# Altium schematic sheet 15-PWR_1.SchDoc: KARGOBOT-TBOX-V2.0
size 513 x 386 mm; Page Create Date: March  8, 1995; Page Number: 4; Page Size: C; Page Count: 81; RevCode: A; DsnPath: C:\Users\Administrator\Desktop\123\KARGOBOT-TCU-ORIN-V1.1.DSN; SchematicName: KARGOBT-TCU-ORIN-V1.1; PageName: N100; PageSize: C; TopSchematic: True
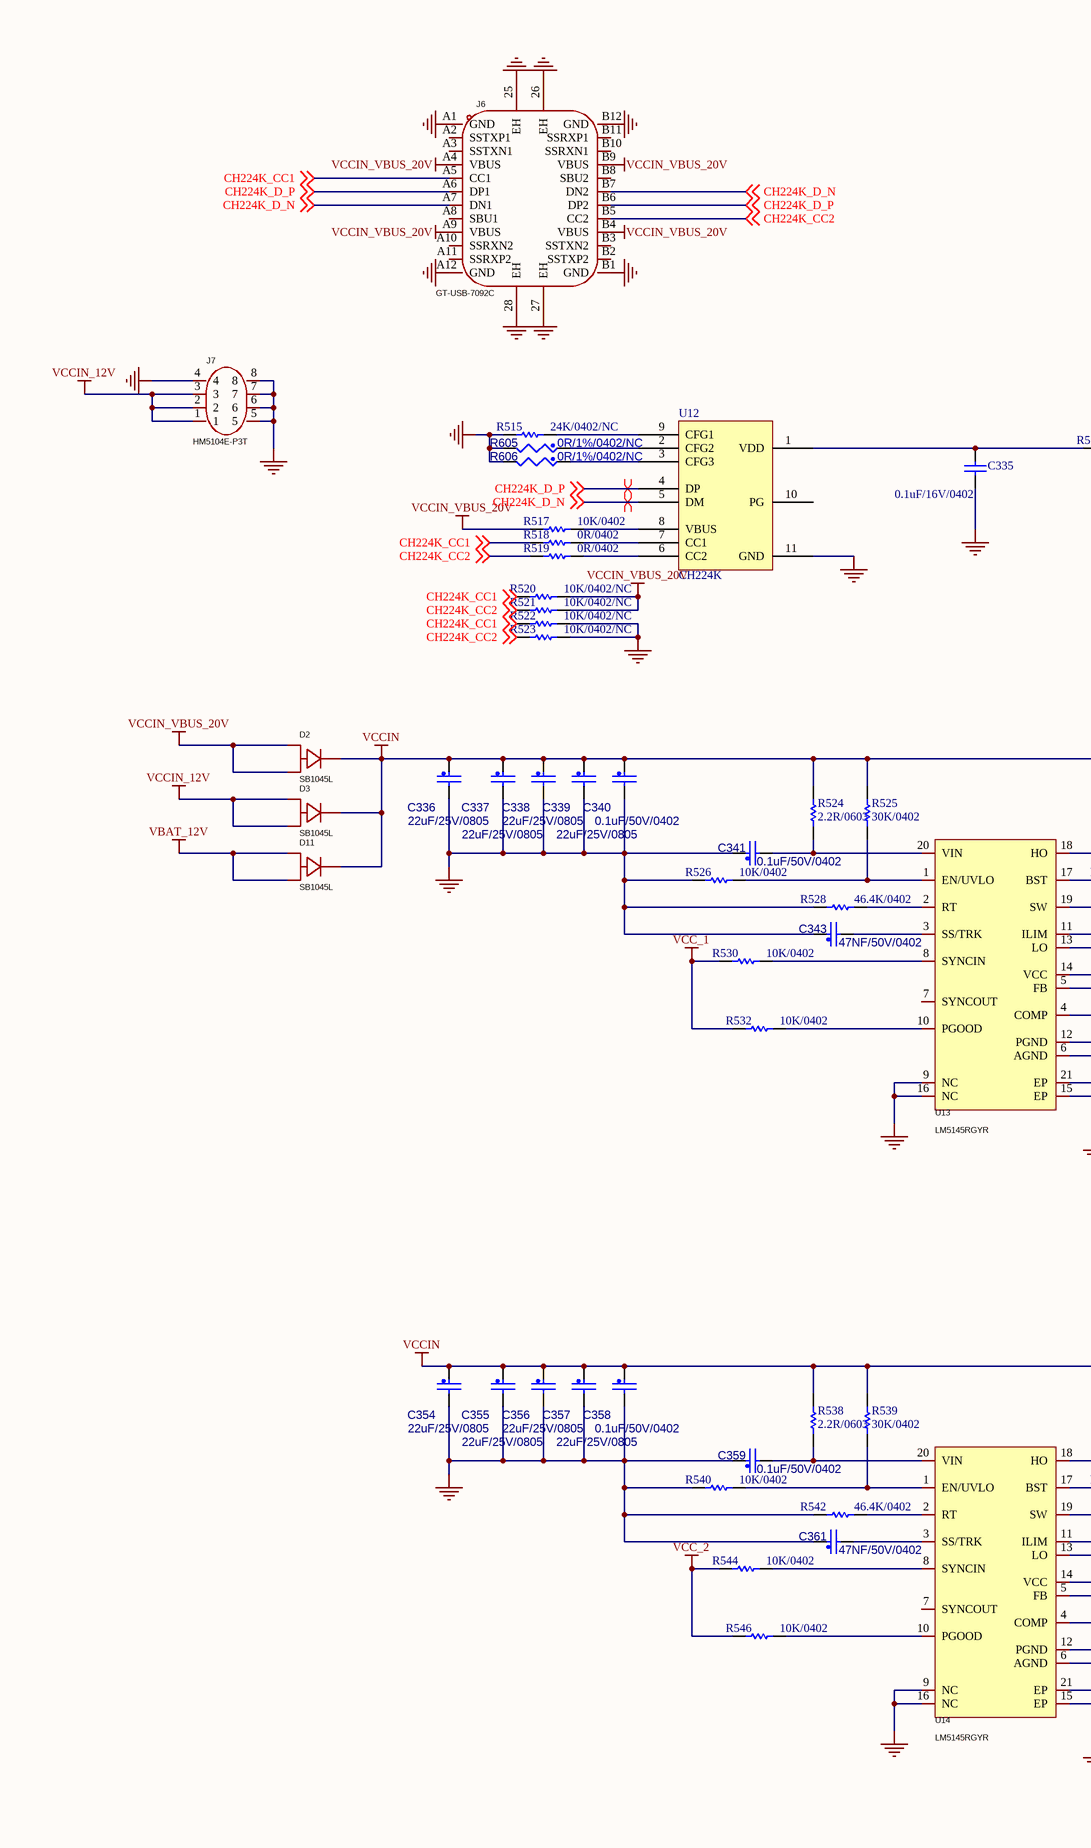
[diagram p0: 15-PWR_1.SchDoc, left]
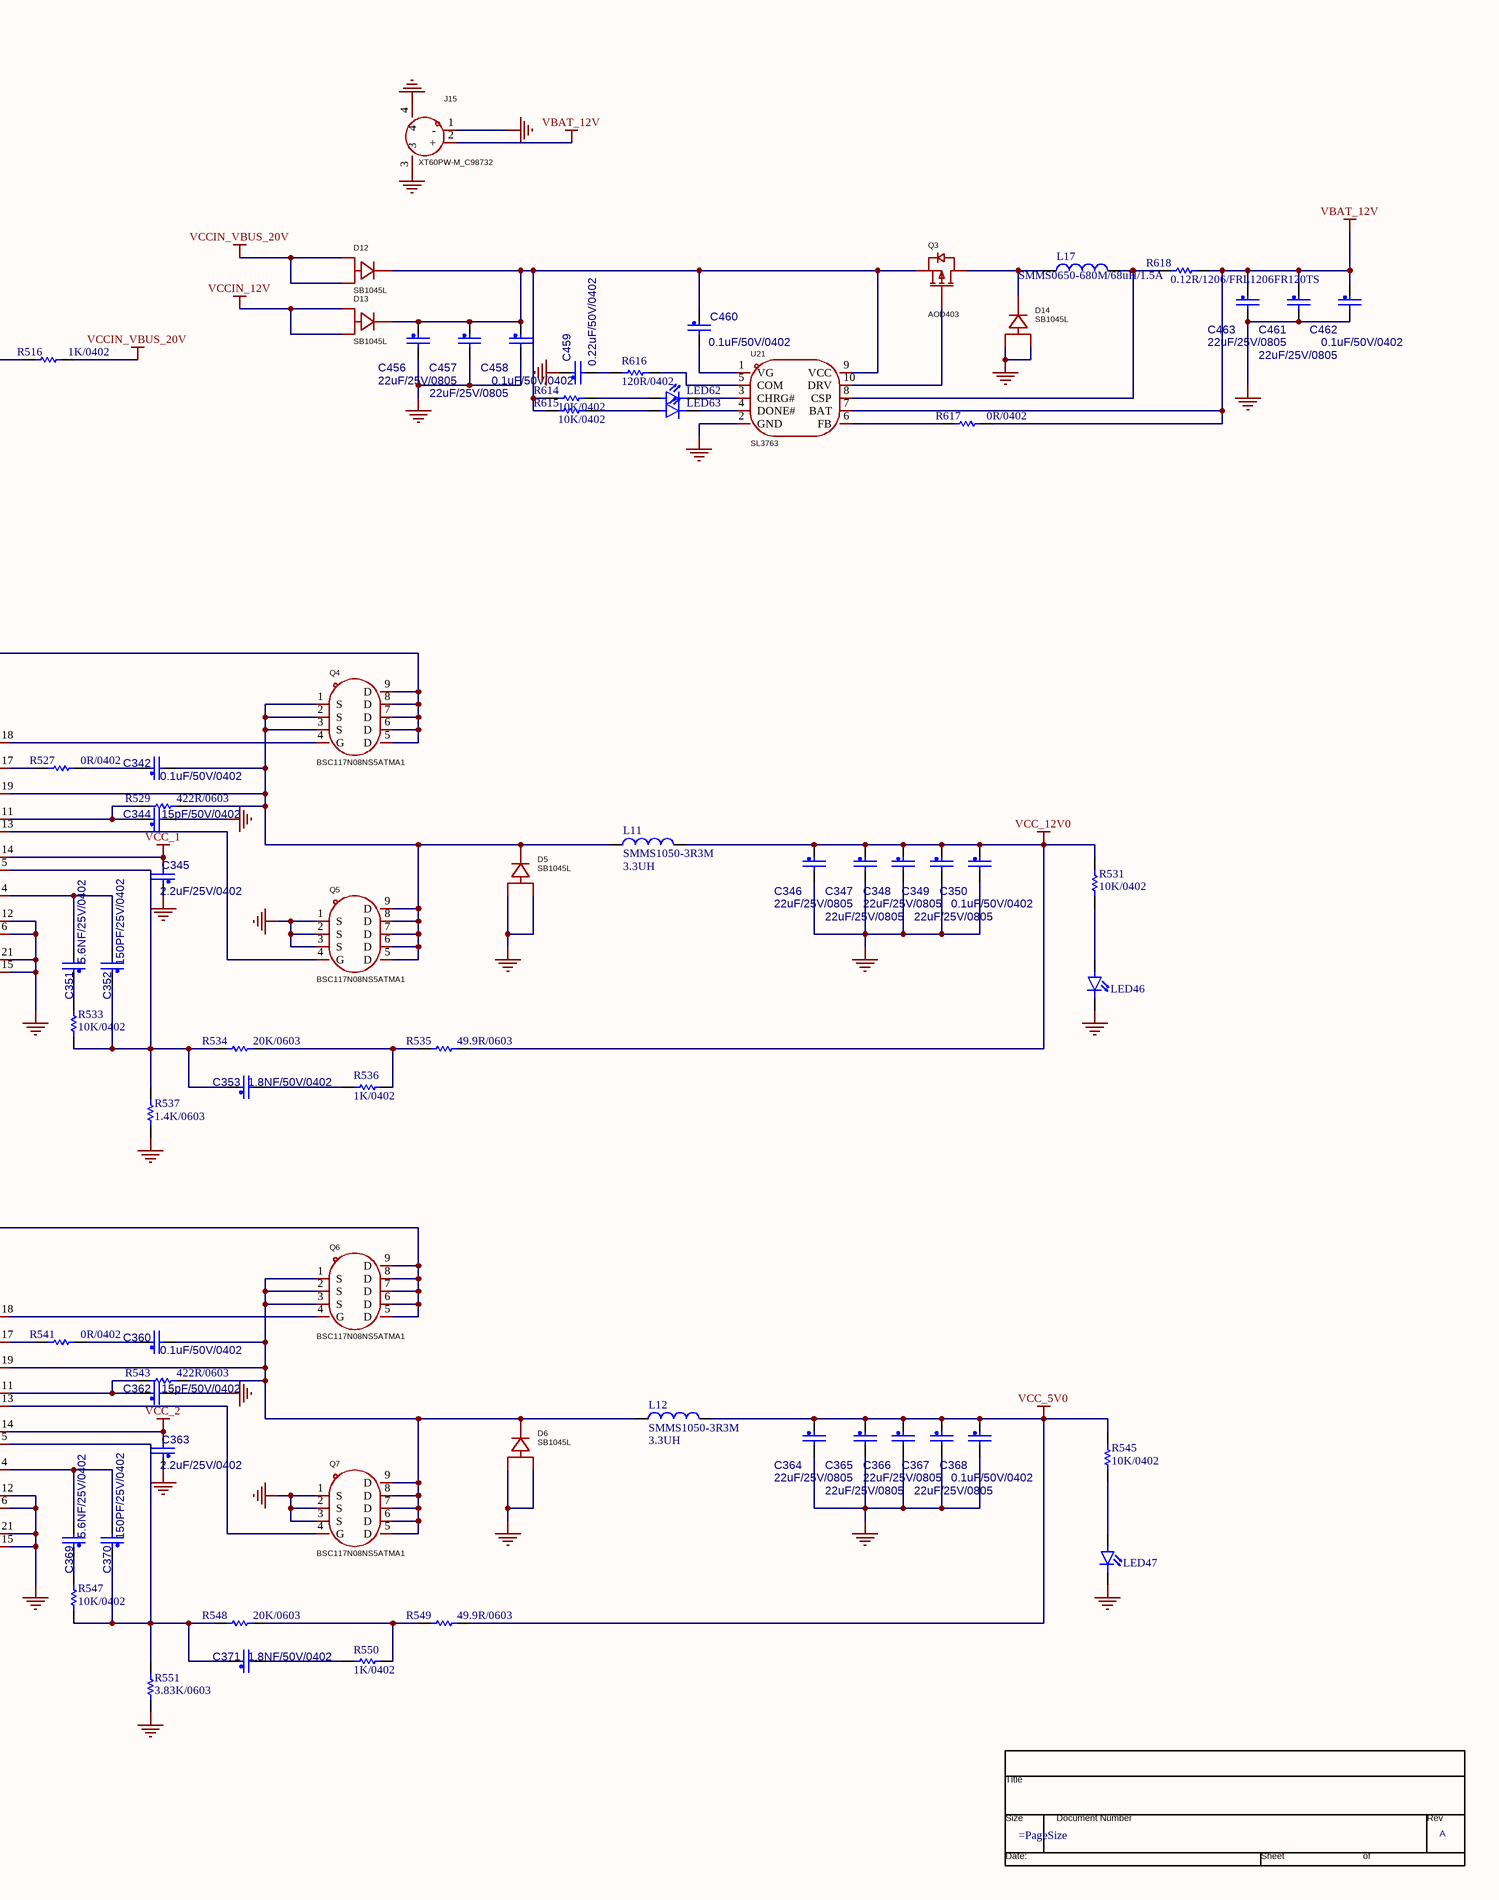
[diagram p1: 15-PWR_1.SchDoc, right]

## Parts
*  RevCode: A  (graphical)
C335  0.1uF/16V/0402  [C0402]
C336  value 22uF/25V/0805  [C0805]  (hidden comment: CAP_NP)
C337  value 22uF/25V/0805  [C0805]  (hidden comment: CAP_NP)
C338  value 22uF/25V/0805  [C0805]  (hidden comment: CAP_NP)
C339  value 22uF/25V/0805  [C0805]  (hidden comment: CAP_NP)
C340  value 0.1uF/50V/0402  [C0402]  (hidden comment: CAP_NP)
C341  value 0.1uF/50V/0402  [C0402]  (hidden comment: CAP_NP)
C342  value 0.1uF/50V/0402  [C0402]  (hidden comment: CAP_NP)
C343  value 47NF/50V/0402  [C0402]  (hidden comment: CAP_NP)
C344  value 15pF/50V/0402  [C0402]  (hidden comment: CAP_NP)
C345  value 2.2uF/25V/0402  [C0402]  (hidden comment: CAP_NP)
C346  value 22uF/25V/0805  [C0805]  (hidden comment: CAP_NP)
C347  value 22uF/25V/0805  [C0805]  (hidden comment: CAP_NP)
C348  value 22uF/25V/0805  [C0805]  (hidden comment: CAP_NP)
C349  value 22uF/25V/0805  [C0805]  (hidden comment: CAP_NP)
C350  value 0.1uF/50V/0402  [C0402]  (hidden comment: CAP_NP)
C351  value 5.6NF/25V/0402  [C0402]  (hidden comment: CAP_NP)
C352  value 150PF/25V/0402  [C0402]  (hidden comment: CAP_NP)
C353  value 1.8NF/50V/0402  [C0402]  (hidden comment: CAP_NP)
C354  value 22uF/25V/0805  [C0805]  (hidden comment: CAP_NP)
C355  value 22uF/25V/0805  [C0805]  (hidden comment: CAP_NP)
C356  value 22uF/25V/0805  [C0805]  (hidden comment: CAP_NP)
C357  value 22uF/25V/0805  [C0805]  (hidden comment: CAP_NP)
C358  value 0.1uF/50V/0402  [C0402]  (hidden comment: CAP_NP)
C359  value 0.1uF/50V/0402  [C0402]  (hidden comment: CAP_NP)
C360  value 0.1uF/50V/0402  [C0402]  (hidden comment: CAP_NP)
C361  value 47NF/50V/0402  [C0402]  (hidden comment: CAP_NP)
C362  value 15pF/50V/0402  [C0402]  (hidden comment: CAP_NP)
C363  value 2.2uF/25V/0402  [C0402]  (hidden comment: CAP_NP)
C364  value 22uF/25V/0805  [C0805]  (hidden comment: CAP_NP)
C365  value 22uF/25V/0805  [C0805]  (hidden comment: CAP_NP)
C366  value 22uF/25V/0805  [C0805]  (hidden comment: CAP_NP)
C367  value 22uF/25V/0805  [C0805]  (hidden comment: CAP_NP)
C368  value 0.1uF/50V/0402  [C0402]  (hidden comment: CAP_NP)
C369  value 5.6NF/25V/0402  [C0402]  (hidden comment: CAP_NP)
C370  value 150PF/25V/0402  [C0402]  (hidden comment: CAP_NP)
C371  value 1.8NF/50V/0402  [C0402]  (hidden comment: CAP_NP)
C456  value 22uF/25V/0805  [C0805]  (hidden comment: CAP_NP)
C457  value 22uF/25V/0805  [C0805]  (hidden comment: CAP_NP)
C458  value 0.1uF/50V/0402  [C0402]  (hidden comment: CAP_NP)
C459  value 0.22uF/50V/0402  [C0402]  (hidden comment: CAP_NP)
C460  value 0.1uF/50V/0402  [C0402]  (hidden comment: CAP_NP)
C461  value 22uF/25V/0805  [C0805]  (hidden comment: CAP_NP)
C462  value 0.1uF/50V/0402  [C0402]  (hidden comment: CAP_NP)
C463  value 22uF/25V/0805  [C0805]  (hidden comment: CAP_NP)
D2  SB1045L  [TO-277_3P-L5.4-W4.0-LS6.5-TR]
D3  SB1045L  [TO-277_3P-L5.4-W4.0-LS6.5-TR]
D5  SB1045L  [TO-277_3P-L5.4-W4.0-LS6.5-TR]
D6  SB1045L  [TO-277_3P-L5.4-W4.0-LS6.5-TR]
D11  SB1045L  [TO-277_3P-L5.4-W4.0-LS6.5-TR]
D12  SB1045L  [TO-277_3P-L5.4-W4.0-LS6.5-TR]
D13  SB1045L  [TO-277_3P-L5.4-W4.0-LS6.5-TR]
D14  SB1045L  [TO-277_3P-L5.4-W4.0-LS6.5-TR]
J6  GT-USB-7092C  [USB-C-SMD_GT-USB-7092C]
J7  HM5104E-P3T  [HM5104E-P3T]
J15  XT60PW-M_C98732  [CONN-TH_XT60PW-M]
L11  SMMS1050-3R3M  value 3.3UH  [SMMS1050-3R3M]
L12  SMMS1050-3R3M  value 3.3UH  [SMMS1050-3R3M]
L17  SMMS0650-680M/68uH/1.5A  [SMMS0650-680M]
LED46  LED_GREEN  [LED0603]  (value not drawn)
LED47  LED_GREEN  [LED0603]  (value not drawn)
LED62  LED_GREEN  [LED0603]  (value not drawn)
LED63  LED_GREEN  [LED0603]  (value not drawn)
Q3  AOD403  [TO-252-3_L6.6-W6.1-P4.58-LS10.1-BR-2]
Q4  BSC117N08NS5ATMA1  [DFN-8_L5.9-W5.2-P1.27-LS6.2-BL]
Q5  BSC117N08NS5ATMA1  [DFN-8_L5.9-W5.2-P1.27-LS6.2-BL]
Q6  BSC117N08NS5ATMA1  [DFN-8_L5.9-W5.2-P1.27-LS6.2-BL]
Q7  BSC117N08NS5ATMA1  [DFN-8_L5.9-W5.2-P1.27-LS6.2-BL]
R515  24K/0402/NC  [R0402]
R516  1K/0402  [R0402]
R517  10K/0402  [R0402]
R518  0R/0402  [R0402]
R519  0R/0402  [R0402]
R520  10K/0402/NC  [R0402]
R521  10K/0402/NC  [R0402]
R522  10K/0402/NC  [R0402]
R523  10K/0402/NC  [R0402]
R524  2.2R/0603  [R0603]
R525  30K/0402  [R0402]
R526  10K/0402  [R0402]
R527  0R/0402  [R0402]
R528  46.4K/0402  [R0402]
R529  422R/0603  [R0603]
R530  10K/0402  [R0402]
R531  10K/0402  [R0402]
R532  10K/0402  [R0402]
R533  10K/0402  [R0402]
R534  20K/0603  [R0603]
R535  49.9R/0603  [R0603]
R536  1K/0402  [R0402]
R537  1.4K/0603  [R0603]
R538  2.2R/0603  [R0603]
R539  30K/0402  [R0402]
R540  10K/0402  [R0402]
R541  0R/0402  [R0402]
R542  46.4K/0402  [R0402]
R543  422R/0603  [R0603]
R544  10K/0402  [R0402]
R545  10K/0402  [R0402]
R546  10K/0402  [R0402]
R547  10K/0402  [R0402]
R548  20K/0603  [R0603]
R549  49.9R/0603  [R0603]
R550  1K/0402  [R0402]
R551  3.83K/0603  [R0603]
R605  value 0R/1%/0402/NC  [R0402]  (hidden comment: RES_Dup2)
R606  value 0R/1%/0402/NC  [R0402]  (hidden comment: RES_Dup2)
R614  10K/0402  [R0402]
R615  10K/0402  [R0402]
R616  120R/0402  [R0402]
R617  0R/0402  [R0402]
R618  0.12R/1206/FRL1206FR120TS  [R1206]
U12  CH224K  [CH224K_ ESSOP-10]
U13  LM5145RGYR  [VQFN-20_L4.5-W3.5-P0.50-BL-EP]
U14  LM5145RGYR  [VQFN-20_L4.5-W3.5-P0.50-BL-EP]
U21  SL3763  [SSOP-10_L4.9-W3.9-P1.00-LS6.0-BL-1]

## Nets
GND: C335.1 C336.2 C337.2 C338.2 C339.2 C340.2 C341.1 C343.1 C344.2 C345.1 C346.2 C347.2 C348.2 C349.2 C350.2 C354.2 C355.2 C356.2 C357.2 C358.2 C359.1 C361.1 C362.2 C363.1 C364.2 C365.2 C366.2 C367.2 C368.2 C456.2 C457.2 C458.2 C459.1 C461.2 C462.2 C463.2 D5.1(A) D5.3(A) D6.1(A) D6.3(A) D14.1(A) D14.3(A) J6.25(EH) J6.26(EH) J6.27(EH) J6.28(EH) J6.A1(GND) J6.A12(GND) J6.B1(GND) J6.B12(GND) J7.4 J7.5 J7.6 J7.7 J7.8 J15.1(-) J15.3 J15.4 LED46.2 LED47.2 Q5.1(S) Q5.2(S) Q5.3(S) Q7.1(S) Q7.2(S) Q7.3(S) R515.1 R522.2 R523.2 R526.1 R528.2 R537.2 R540.1 R542.2 R551.2 R605.2 R606.2 U12.11(GND) U13.6(AGND) U13.9(NC) U13.12(PGND) U13.15(EP) U13.16(NC) U13.21(EP) U14.6(AGND) U14.9(NC) U14.12(PGND) U14.15(EP) U14.16(NC) U14.21(EP) U21.2(GND)
VBAT_12V: C461.1 C462.1 C463.1 D11.1(A) D11.3(A) J15.2(+) R617.2 R618.2 U21.7(BAT)
VCC_1: C345.2 R530.1 R532.1 U13.14(VCC)
VCC_2: C363.2 R544.1 R546.1 U14.14(VCC)
VCC_5V0: C364.1 C365.1 C366.1 C367.1 C368.1 L12.2 R545.1 R549.1
VCC_12V0: C346.1 C347.1 C348.1 C349.1 C350.1 L11.2 R531.1 R535.1
VCCIN: C336.1 C337.1 C338.1 C339.1 C340.1 C354.1 C355.1 C356.1 C357.1 C358.1 D2.2(K) D3.2(K) D11.2(K) Q4.5(D) Q4.6(D) Q4.7(D) Q4.8(D) Q4.9(D) Q6.5(D) Q6.6(D) Q6.7(D) Q6.8(D) Q6.9(D) R524.2 R525.2 R538.2 R539.2
VCCIN_12V: D3.1(A) D3.3(A) D13.1(A) D13.3(A) J7.1 J7.2 J7.3
VCCIN_VBUS_20V: D2.1(A) D2.3(A) D12.1(A) D12.3(A) J6.A4(VBUS) J6.A9(VBUS) J6.B4(VBUS) J6.B9(VBUS) R516.2 R517.1 R520.2 R521.2
CH224K_CC1: J6.A5(CC1) R518.1 R520.1 R522.1 ; off-sheet CH224K_CC1
CH224K_CC2: J6.B5(CC2) R519.1 R521.1 R523.1 ; off-sheet CH224K_CC2
CH224K_D_N: J6.A7(DN1) J6.B7(DN2) U12.5(DM) ; off-sheet CH224K_D_N
CH224K_D_P: J6.A6(DP1) J6.B6(DP2) U12.4(DP) ; off-sheet CH224K_D_P
NetC335_2: C335.2 R516.1 U12.1(VDD)
NetC341_2: C341.2 R524.1 U13.20(VIN)
NetC342_1: C342.1 R527.2
NetC342_2: C342.2 D5.2(K) L11.1 Q4.1(S) Q4.2(S) Q4.3(S) Q5.5(D) Q5.6(D) Q5.7(D) Q5.8(D) Q5.9(D) R529.1 U13.19(SW)
NetC343_2: C343.2 U13.3(SS/TRK)
NetC344_1: C344.1 R529.2 U13.11(ILIM)
NetC351_1: C351.1 R533.2
NetC351_2: C351.2 C352.2 U13.4(COMP)
NetC352_1: C352.1 C353.1 R533.1 R534.2 R537.1 U13.5(FB)
NetC353_2: C353.2 R536.2
NetC359_2: C359.2 R538.1 U14.20(VIN)
NetC360_1: C360.1 R541.2
NetC360_2: C360.2 D6.2(K) L12.1 Q6.1(S) Q6.2(S) Q6.3(S) Q7.5(D) Q7.6(D) Q7.7(D) Q7.8(D) Q7.9(D) R543.1 U14.19(SW)
NetC361_2: C361.2 U14.3(SS/TRK)
NetC362_1: C362.1 R543.2 U14.11(ILIM)
NetC369_1: C369.1 R547.2
NetC369_2: C369.2 C370.2 U14.4(COMP)
NetC370_1: C370.1 C371.1 R547.1 R548.2 R551.1 U14.5(FB)
NetC371_2: C371.2 R550.2
NetC456_1: C456.1 C457.1 C458.1 C460.1 D12.2(K) D13.2(K) Q3.3(S) R614.1 R615.1 U21.9(VCC)
NetC459_2: C459.2 R616.1
NetC460_2: C460.2 U21.1(VG)
NetD14_2: D14.2(K) L17.1 Q3.2(D)
NetL17_2: L17.2 R618.1 U21.8(CSP)
NetLED46_1: LED46.1 R531.2
NetLED47_1: LED47.1 R545.2
NetLED62_1: LED62.1 R614.2
NetLED62_2: LED62.2 U21.3(CHRG#)
NetLED63_1: LED63.1 R615.2
NetLED63_2: LED63.2 U21.4(DONE#)
NetQ3_1: Q3.1(G) U21.10(DRV)
NetQ4_4: Q4.4(G) U13.18(HO)
NetQ5_4: Q5.4(G) U13.13(LO)
NetQ6_4: Q6.4(G) U14.18(HO)
NetQ7_4: Q7.4(G) U14.13(LO)
NetR515_2: R515.2 U12.9(CFG1)
NetR517_2: R517.2 U12.8(VBUS)
NetR518_2: R518.2 U12.7(CC1)
NetR519_2: R519.2 U12.6(CC2)
NetR525_1: R525.1 R526.2 U13.1(EN/UVLO)
NetR527_1: R527.1 U13.17(BST)
NetR528_1: R528.1 U13.2(RT)
NetR530_2: R530.2 U13.8(SYNCIN)
NetR532_2: R532.2 U13.10(PGOOD)
NetR534_1: R534.1 R535.2 R536.1
NetR539_1: R539.1 R540.2 U14.1(EN/UVLO)
NetR541_1: R541.1 U14.17(BST)
NetR542_1: R542.1 U14.2(RT)
NetR544_2: R544.2 U14.8(SYNCIN)
NetR546_2: R546.2 U14.10(PGOOD)
NetR548_1: R548.1 R549.2 R550.1
NetR605_1: R605.1 U12.2(CFG2)
NetR606_1: R606.1 U12.3(CFG3)
NetR616_2: R616.2 U21.5(COM)
NetR617_1: R617.1 U21.6(FB)

Not connected (* = marked no-connect by the designer): J6 A2(SSTXP1) A3(SSTXN1) A8(SBU1) A10(SSRXN2) A11(SSRXP2) B2(SSTXP2) B3(SSTXN2) B8(SBU2) B10(SSRXN1) B11(SSRXP1); U12 10(PG); U13 7(SYNCOUT); U14 7(SYNCOUT)

## Layout directives
differential pair: CH224K_D_N, CH224K_D_P

## Notes on the sheet
- (in symbol TitleBlock0) Title; Size; Document Number; Rev; Date:; Sheet; of

## Library data of the parts
* = TitleBlock0: Page Count: 81; Page Number: 4; Title: KARGOBOT-TBOX-V2.0; Page Size: =PageSize; Page Create Date: March  8, 1995; Page Modify Date: =ModifiedDate
C335 = CAP: Capacitor; Value: 100pF; Published: 8-Jun-2000; Revision: July-2002: Re-released for DXP Platform.; Publisher: Altium Limited
C336-C339 C346-C349 C354-C357 C364-C367 C456 C457 C461 C463 = CAP_NP: GRT31CC71E226ME13/MURATA; Part Reference: C13; CLASS: DISCRETE; VOLTAGE: 10v; CAD_APPROVED: Yes; MFG_PN01: C1608X5R1A106K; MFG_NAME01: TDK; TOL: 10%; AGILE_PN: 150-78675; FPLIST: CC0603_OV,CC0603,0603_CC; PCB Footprint: C1206; HEIGHT: 1.016MM; ROHS: Yes; Tolerance: 10%
C340-C345 C350-C353 C358-C363 C368-C371 C458-C460 C462 = CAP_NP: GCM155R71H104KE02/MURATA; Part Reference: C15; CLASS: DISCRETE; FPLIST: CC0402_25,CC0402_HD,CC0402_CC; CAD_APPROVED: Yes; MFG_PN01: 0402YC104KAT2A; MFG_NAME01: AVX; Tolerance: 10%; AGILE_PN: 150-75182; VOLTAGE: 16V; HEIGHT: 0.635MM; ROHS: Yes; TOL: 10%; PCB Footprint: C0402
D2 D3 D5 D6 D11-D14 = SB1045L_C908747: Manufacturer: GOODWORK(固得沃克); Add into BOM: yes; Diode Configuration: 独立式; Forward Voltage (Vf@If): 530mV@10A; Reverse Voltage (Vr): 45V; Average Rectified Current (Io): 10A; Reverse Leakage Current (Ir): 150uA@45V; Symbol: SB1045L_C908747; Device: SB1045L_C908747; LCSC Part Name: 电压:45V 电流:10A; Supplier Part: C908747; Manufacturer Part: SB1045L; Supplier Footprint: TO-277; JLCPCB Part Class: Extended Part; Datasheet: https://atta.szlcsc.com/upload/public/pdf/source/20210105/C908747_DE348528BC53D9CC51537B568EB9903F.pdf; Supplier: LCSC; Convert to PCB: yes; Comment_1: SB1045L
J6 = GT-USB-7092C: Manufacturer: G-Switch(品赞); Add into BOM: yes; Connector Type: Type-C; Gender: 母; Number of Contacts: 24P; Number of Ports: 1; Current Rating - Power (Max): 5A; Rated Voltage (Max): 24V; Connect-Disconnect Life: 1万次; Center Height: 7.2mm; Core Colour: 黑色; Symbol: GT-USB-7092C; Device: GT-USB-7092C; LCSC Part Name: Type-C 母 侧贴; Supplier Part: C22471968; Manufacturer Part: GT-USB-7092C; Supplier Footprint: SMD; JLCPCB Part Class: Extended Part; Datasheet: https://atta.szlcsc.com/upload/public/pdf/source/20240624/0752ADA6134B10077FCDD9A2DA872EFC.pdf; Supplier: LCSC; Convert to PCB: yes; Standard: USB 3.1; Mounting Style: 侧贴; Length: 13.9mm; Operating Temperature Range: -40℃~+85℃; Comment_1: GT-USB-7092C
J7 = 1726750814: Manufacturer: MOLEX; Add into BOM: yes; Row Spacing: 4.2mm; Symbol: 1726750814; Device: 1726750814; LCSC Part Name: 1726750814; Supplier Part: C17608453; Manufacturer Part: 1726750814; Supplier Footprint: 插件; JLCPCB Part Class: Extended Part; Datasheet: https://www.molex.com/content/dam/molex/molex-dot-com/products/automated/en-us/salesdrawingpdf/172/172675/1726750814_sd.pdf?inline; Supplier: LCSC; Convert to PCB: yes; Mounting Style: 直插; Number of Rows: 2; Contact Material: 铜合金; Contact Plating: 锡; Comment_1: 1726750814
J15 = XT60PW-M: Manufacturer: AMASS(艾迈斯); Add into BOM: yes; Brand: 艾迈斯; InterfaceType: 公头; Symbol: XT60PW-M; Device: XT60PW-M; LCSC Part Name: AMASS(艾迈斯)航模插头xt60连接器150公母对接pw锂电池公头 板插卧式XT60PW-M; Supplier Part: C98732; Manufacturer Part: XT60PW-M; Supplier Footprint: -; JLCPCB Part Class: Extended Part; Datasheet: https://atta.szlcsc.com/upload/public/pdf/source/20240118/44A3DCFF53BE25DC65378AFFB21277A4.pdf; Supplier: LCSC; Convert to PCB: yes; Model: XT60PW-M; Power: -; Output: -; Input: -; Size: -; Interface: -; Type: 卧式插头; Colour: 黄色; MaximumCurrent: -; RatedVoltage: -; Type1: -; NumberOfUSBHoles: -; MetalMaterial: -; InsulationMaterial: -; RatedCurrent: -; RecommendedWireGauge: -; FlameRetardantGrade: -; contact resistance: -; Belt length: -; specifications: -
L11 L12 = Inductor: Code_IEC: 1005; Published: 8-Jun-2000; LatestRevisionDate: 29-May-2009; LatestRevisionNote: IPC-7351 Footprint Added.; PackageReference: 0402-A; Publisher: Altium Limited; PackageDescription: Chip Inductor; Code_JEITA: 0402
L17 = Inductor: FXC0630-5R6M; Code_IEC: 1005; Value: 2.2uH; Published: 8-Jun-2000; LatestRevisionDate: 29-May-2009; LatestRevisionNote: IPC-7351 Footprint Added.; PackageReference: 0402-A; Publisher: Altium Limited; PackageDescription: Chip Inductor; Code_JEITA: 0402
LED46 LED47 LED62 LED63 = LED
Q3 = AOD403_C5224305: Manufacturer: ElecSuper(静芯微); Add into BOM: yes; Type: 1个P沟道; Drain Source Voltage (Vdss): 30V; Continuous Drain Current (Id): 62A; Drain Source On Resistance (RDS(on)@Vgs,Id): 8mΩ@10V; Power Dissipation (Pd): 79W; Gate Threshold Voltage (Vgs(th)@Id): 2V@20A; Total Gate Charge (Qg@Vgs): 61nC; Input Capacitance (Ciss@Vds): 3.5nF@0V; Reverse Transfer Capacitance (Crss@Vds): 660pF@15V; Symbol: AOD403_C5224305; Device: AOD403_C5224305; LCSC Part Name: P沟道,电流:62A,耐压:30V; Supplier Part: C5224305; Manufacturer Part: AOD403; Supplier Footprint: TO-252; JLCPCB Part Class: Extended Part; Datasheet: https://atta.szlcsc.com/upload/public/pdf/source/20240905/94D7CD2F64083621076EDE6D140A89A0.pdf; Supplier: LCSC; Convert to PCB: yes; Operating Temperature: -55℃~+150℃; Comment_1: AOD403
Q4-Q7 = BSC117N08NS5ATMA1-VB: Manufacturer: VBsemi(微碧半导体); Add into BOM: yes; Symbol: BSC117N08NS5ATMA1-VB; Device: BSC117N08NS5ATMA1-VB; LCSC Part Name: BSC117N08NS5ATMA1-VB; Supplier Part: C22395965; Manufacturer Part: BSC117N08NS5ATMA1-VB; Supplier Footprint: DFN-8(5x6); JLCPCB Part Class: Extended Part; Datasheet: https://atta.szlcsc.com/upload/public/pdf/source/20240509/FBEE2FAA355846CAD7B0AB561ACDED61.pdf; Supplier: LCSC; Convert to PCB: yes; Comment_1: BSC117N08NS5ATMA1-VB
R515-R530 R532-R544 R546-R551 R617 = Res Semi: Semiconductor Resistor; Value: 240R; Published: 8-Jun-2000; LatestRevisionDate: 17-Jul-2002; LatestRevisionNote: Re-released for DXP Platform.; PackageReference: AXIAL-0.5; Publisher: Altium Limited; PackageDescription: Axial Device, Thru-Hole; 2 Leads; 0.5 in Pin Spacing
R531 R545 R614-R616 R618 = Res Semi: Semiconductor Resistor; Value: 1K; Published: 8-Jun-2000; LatestRevisionDate: 17-Jul-2002; LatestRevisionNote: Re-released for DXP Platform.; PackageReference: AXIAL-0.5; Publisher: Altium Limited; PackageDescription: Axial Device, Thru-Hole; 2 Leads; 0.5 in Pin Spacing
R605 R606 = RES_Dup2: AC0402FR-070RL/YAGEO; Part Reference: R97; CLASS: DISCRETE; SIGNAL_MODEL: DEFAULT_RESISTOR_33.000000OHM_2_1; FPLIST: RC0603_OV; CAD_APPROVED: Yes; MFG_PN01: CR-02FL6---33R; MFG_NAME01: YAGEO; Tolerance: 1%; AGILE_PN: 470-75790; TOL: 5%; ROHS: Yes; HEIGHT: 0.4MM; PCB Footprint: R0402
U13 U14 = LM5145RGYR: Manufacturer: TI(德州仪器); Add into BOM: yes; Function: 降压型; Input Voltage: 6V~75V; Switching Frequency: 1MHz; Synchronous Rectification: 是; Number of Outputs: 1; Topology: 降压式; Symbol: LM5145RGYR; Device: LM5145RGYR; LCSC Part Name: LM5145RGYR; Supplier Part: C485912; Manufacturer Part: LM5145RGYR; Supplier Footprint: VQFN-20-EP(3.5x4.5); JLCPCB Part Class: Extended Part; Datasheet: https://www.ti.com/cn/lit/gpn/lm5145; Supplier: LCSC; Convert to PCB: yes; Operating Temperature: -40℃~+125℃@(TJ); Comment_1: LM5145RGYR
U21 = SL3763: Manufacturer: Slkor(萨科微); Add into BOM: yes; The Chip Type: 充电芯片; Supply Voltage: 6.6V~30V; Maximum Charge Current: 4A; Number of Cells: 3; Symbol: SL3763; Device: SL3763; LCSC Part Name: SL3763; Supplier Part: C5122525; Manufacturer Part: SL3763; Supplier Footprint: SSOP-10; JLCPCB Part Class: Extended Part; Datasheet: https://atta.szlcsc.com/upload/public/pdf/source/20220805/EAFE5591DAA5C6B27C0EA0F854AFD0DF.pdf; Supplier: LCSC; Convert to PCB: yes; Operating Temperature: -40℃~+85℃; Comment_1: SL3763